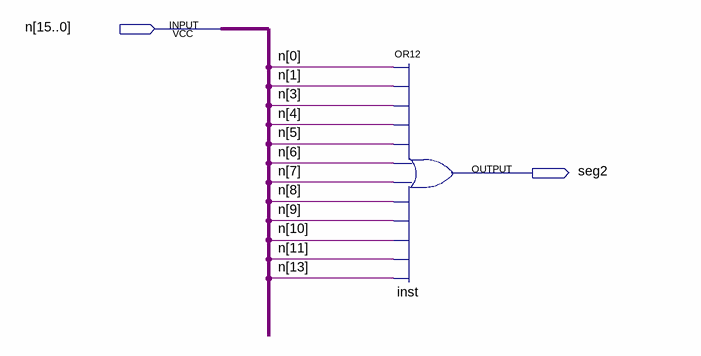
[diagram p0: schematic sheet]
// Quartus schematic seg2.bdf as structural Verilog: 1 symbols, 2 pins
module seg2 (
  input  [15:0] n,
  output seg2
);

  or inst (seg2, n[0], n[1], n[3], n[4], n[5], n[6], n[7], n[8], n[9], n[10], n[11], n[13]);
endmodule
